# EAGLE design R212D (EAGLE 4.11)
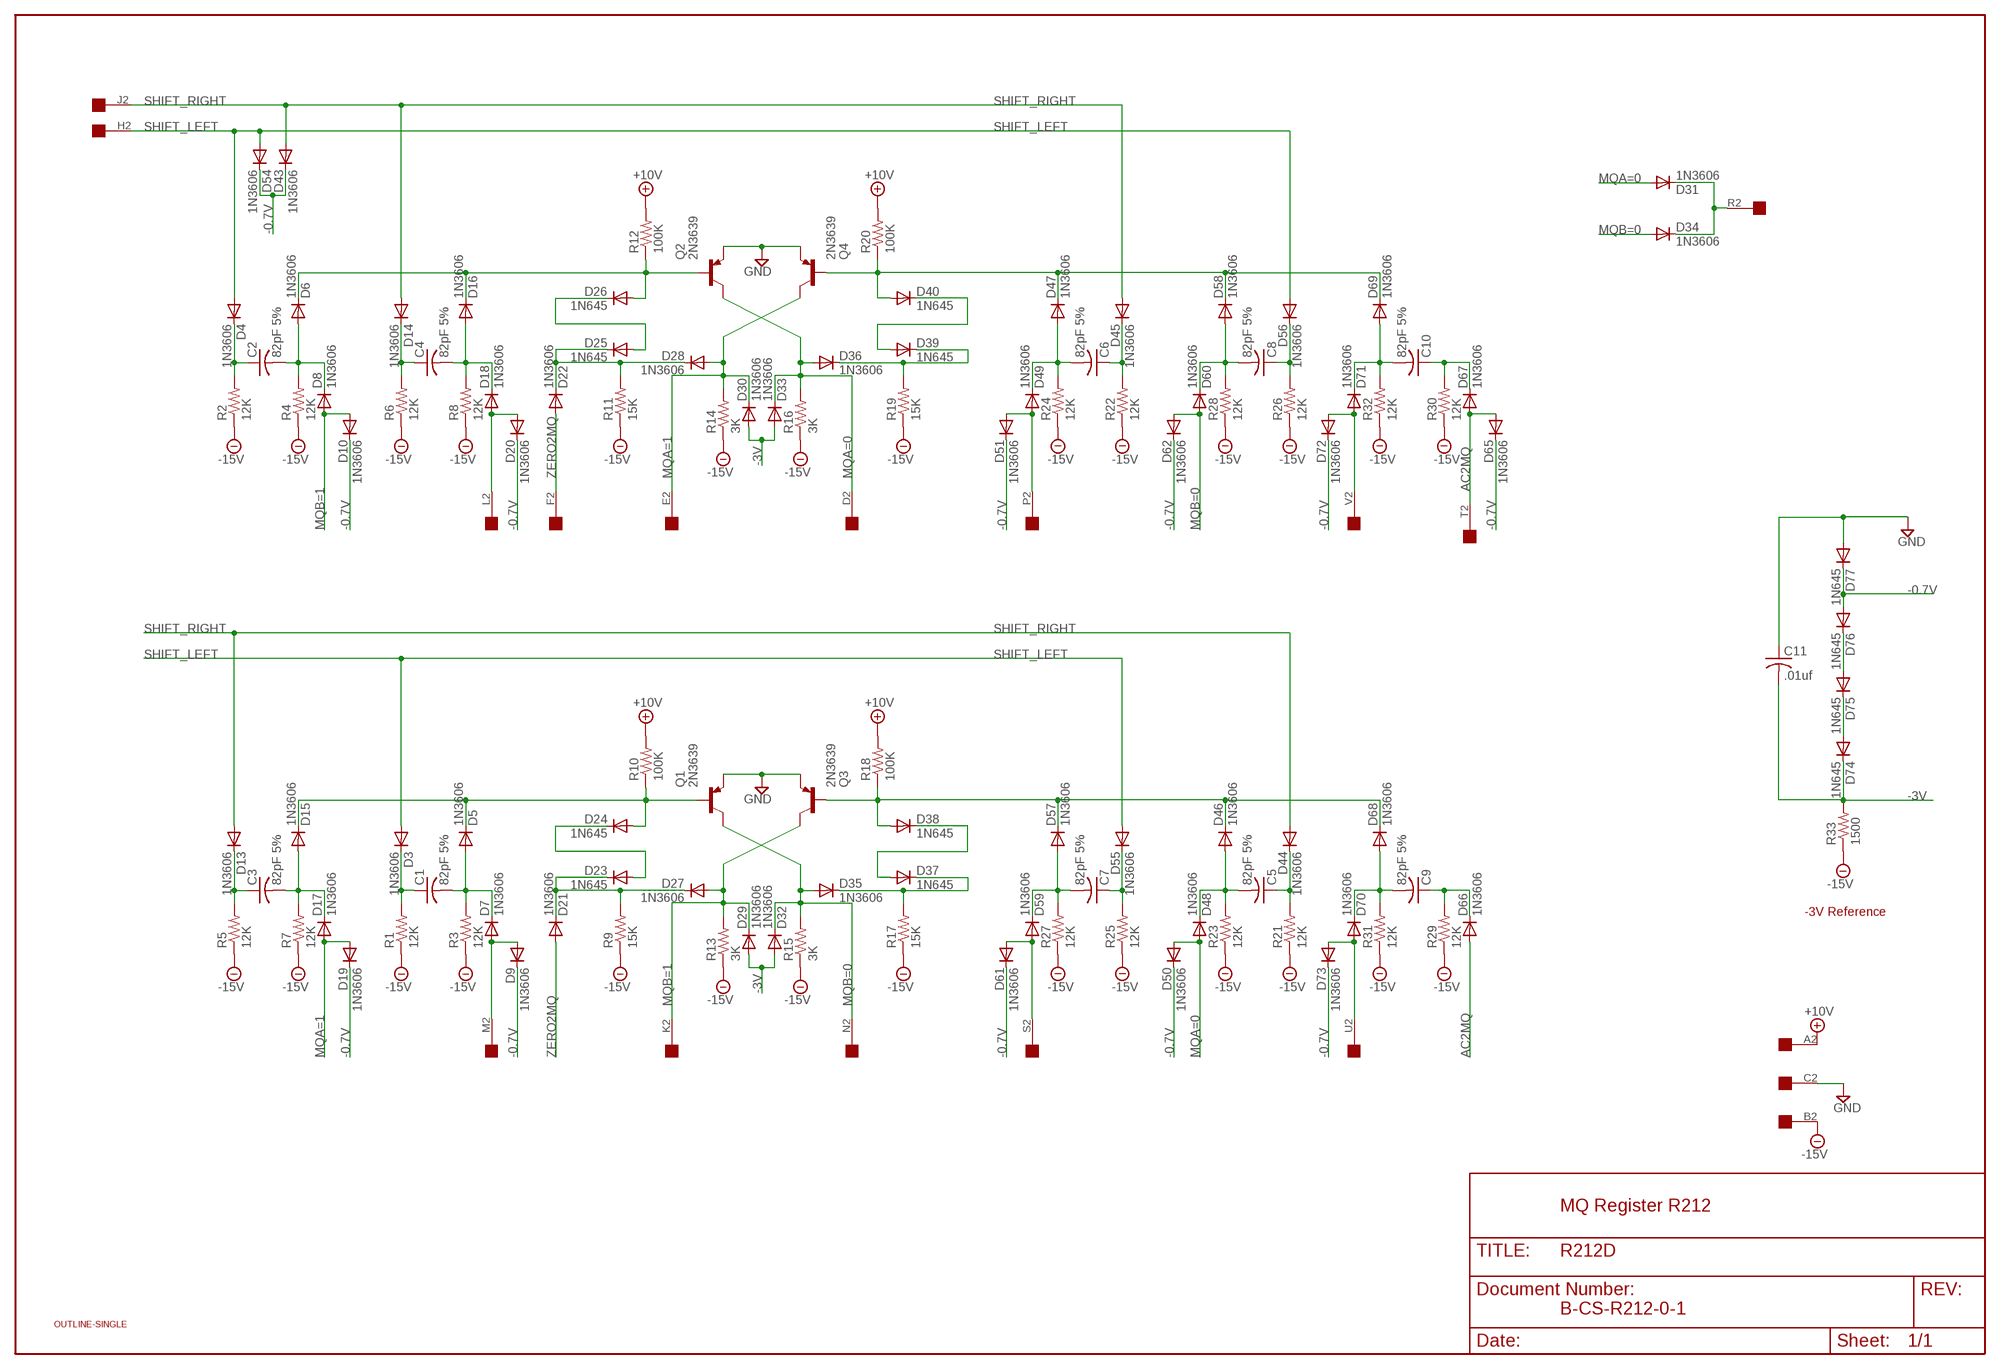
[diagram p0: schematic, sheet 1]

## Parts
C1  82pF 5%  C-US050-025X075  [C050-025X075]
C2  82pF 5%  C-US050-025X075  [C050-025X075]
C3  82pF 5%  C-US050-025X075  [C050-025X075]
C4  82pF 5%  C-US050-025X075  [C050-025X075]
C5  82pF 5%  C-US050-025X075  [C050-025X075]
C6  82pF 5%  C-US050-025X075  [C050-025X075]
C7  82pF 5%  C-US050-025X075  [C050-025X075]
C8  82pF 5%  C-US050-025X075  [C050-025X075]
C9  82pF 5%  C-US050-025X075  [C050-025X075]
C10  82pF 5%  C-US050-025X075  [C050-025X075]
C11  .01uf  C-US050-025X075  [C050-025X075]
D3  1N3606  1N4148  [DO35-10]
D4  1N3606  1N4148  [DO35-10]
D5  1N3606  1N4148  [DO35-10]
D6  1N3606  1N4148  [DO35-10]
D7  1N3606  1N4148  [DO35-10]
D8  1N3606  1N4148  [DO35-10]
D9  1N3606  1N4148  [DO35-10]
D10  1N3606  1N4148  [DO35-10]
D13  1N3606  1N4148  [DO35-10]
D14  1N3606  1N4148  [DO35-10]
D15  1N3606  1N4148  [DO35-10]
D16  1N3606  1N4148  [DO35-10]
D17  1N3606  1N4148  [DO35-10]
D18  1N3606  1N4148  [DO35-10]
D19  1N3606  1N4148  [DO35-10]
D20  1N3606  1N4148  [DO35-10]
D21  1N3606  1N4148  [DO35-10]
D22  1N3606  1N4148  [DO35-10]
D23  1N645  1N4148  [DO35-10]
D24  1N645  1N4148  [DO35-10]
D25  1N645  1N4148  [DO35-10]
D26  1N645  1N4148  [DO35-10]
D27  1N3606  1N4148  [DO35-10]
D28  1N3606  1N4148  [DO35-10]
D29  1N3606  1N4148  [DO35-10]
D30  1N3606  1N4148  [DO35-10]
D31  1N3606  1N4148  [DO35-10]
D32  1N3606  1N4148  [DO35-10]
D33  1N3606  1N4148  [DO35-10]
D34  1N3606  1N4148  [DO35-10]
D35  1N3606  1N4148  [DO35-10]
D36  1N3606  1N4148  [DO35-10]
D37  1N645  1N4148  [DO35-10]
D38  1N645  1N4148  [DO35-10]
D39  1N645  1N4148  [DO35-10]
D40  1N645  1N4148  [DO35-10]
D43  1N3606  1N4148  [DO35-10]
D44  1N3606  1N4148  [DO35-10]
D45  1N3606  1N4148  [DO35-10]
D46  1N3606  1N4148  [DO35-10]
D47  1N3606  1N4148  [DO35-10]
D48  1N3606  1N4148  [DO35-10]
D49  1N3606  1N4148  [DO35-10]
D50  1N3606  1N4148  [DO35-10]
D51  1N3606  1N4148  [DO35-10]
D54  1N3606  1N4148  [DO35-10]
D55  1N3606  1N4148  [DO35-10]
D56  1N3606  1N4148  [DO35-10]
D57  1N3606  1N4148  [DO35-10]
D58  1N3606  1N4148  [DO35-10]
D59  1N3606  1N4148  [DO35-10]
D60  1N3606  1N4148  [DO35-10]
D61  1N3606  1N4148  [DO35-10]
D62  1N3606  1N4148  [DO35-10]
D65  1N3606  1N4148  [DO35-10]
D66  1N3606  1N4148  [DO35-10]
D67  1N3606  1N4148  [DO35-10]
D68  1N3606  1N4148  [DO35-10]
D69  1N3606  1N4148  [DO35-10]
D70  1N3606  1N4148  [DO35-10]
D71  1N3606  1N4148  [DO35-10]
D72  1N3606  1N4148  [DO35-10]
D73  1N3606  1N4148  [DO35-10]
D74  1N645  1N4148  [DO35-10]
D75  1N645  1N4148  [DO35-10]
D76  1N645  1N4148  [DO35-10]
D77  1N645  1N4148  [DO35-10]
Q1  2N3639  2N3637  [TO39]
Q2  2N3639  2N3637  [TO39]
Q3  2N3639  2N3637  [TO39]
Q4  2N3639  2N3637  [TO39]
R1  12K  R-US_0207/10  [0207/10]
R2  12K  R-US_0207/10  [0207/10]
R3  12K  R-US_0207/10  [0207/10]
R4  12K  R-US_0207/10  [0207/10]
R5  12K  R-US_0207/10  [0207/10]
R6  12K  R-US_0207/10  [0207/10]
R7  12K  R-US_0207/10  [0207/10]
R8  12K  R-US_0207/10  [0207/10]
R9  15K  R-US_0207/10  [0207/10]
R10  100K  R-US_0207/10  [0207/10]
R11  15K  R-US_0207/10  [0207/10]
R12  100K  R-US_0207/10  [0207/10]
R13  3K  R-US_0207/10  [0207/10]
R14  3K  R-US_0207/10  [0207/10]
R15  3K  R-US_0207/10  [0207/10]
R16  3K  R-US_0207/10  [0207/10]
R17  15K  R-US_0207/10  [0207/10]
R18  100K  R-US_0207/10  [0207/10]
R19  15K  R-US_0207/10  [0207/10]
R20  100K  R-US_0207/10  [0207/10]
R21  12K  R-US_0207/10  [0207/10]
R22  12K  R-US_0207/10  [0207/10]
R23  12K  R-US_0207/10  [0207/10]
R24  12K  R-US_0207/10  [0207/10]
R25  12K  R-US_0207/10  [0207/10]
R26  12K  R-US_0207/10  [0207/10]
R27  12K  R-US_0207/10  [0207/10]
R28  12K  R-US_0207/10  [0207/10]
R29  12K  R-US_0207/10  [0207/10]
R30  12K  R-US_0207/10  [0207/10]
R31  12K  R-US_0207/10  [0207/10]
R32  12K  R-US_0207/10  [0207/10]
R33  1500  R-US_0207/10  [0207/10]
U$1  OUTLINE-SINGLE  [SINGLE]
U$2  EDGE-1  [EDGE-CON1]

## Nets
+10V [Power]: R10.2 R12.2 R18.2 R20.2 U$2.A2
-0.7V: D9.C D10.C D19.C D20.C D43.C D50.C D51.C D54.C D61.C D62.C D65.C D72.C D73.C D76.A D77.C
-3V [Power]: C11.2 D29.A D30.A D32.A D33.A D74.C R33.2
-15V [Power]: R1.1 R2.1 R3.1 R4.1 R5.1 R6.1 R7.1 R8.1 R9.1 R11.1 R13.1 R14.1 R15.1 R16.1 R17.1 R19.1 R21.1 R22.1 R23.1 R24.1 R25.1 R26.1 R27.1 R28.1 R29.1 R30.1 R31.1 R32.1 R33.1 U$2.B2
AC2MQ: D65.A D66.A D67.A U$2.T2
GND [Power]: C11.1 D77.A Q1.1(E) Q2.1(E) Q3.1(E) Q4.1(E) U$2.C2
MQA=0: D31.A D33.C D36.A D48.A D50.A Q2.3(C) R16.2 U$2.D2
MQA=1: D17.A D19.A D28.A D30.C Q4.3(C) R14.2 U$2.E2
MQB=0: D32.C D34.A D35.A D60.A D62.A Q1.3(C) R15.2 U$2.N2
MQB=1: D8.A D10.A D27.A D29.C Q3.3(C) R13.2 U$2.K2
N$1: D6.C D16.C D26.A Q2.2(B) R12.1
N$2: C2.1 D4.C R2.2
N$3: C2.2 D6.A D8.C R4.2
N$4: C10.1 D67.C R30.2
N$5: C4.1 D14.C R6.2
N$6: C4.2 D16.A D18.C R8.2
N$7: D18.A D20.A U$2.L2
N$8: D22.C D25.C D28.C R11.2
N$9: D25.A D26.C
N$10: C10.2 D69.A D71.C R32.2
N$11: D71.A D72.A U$2.V2
N$12: D40.A D47.C D58.C D69.C Q4.2(B) R20.1
N$13: D75.A D76.C
N$14: D31.C D34.C U$2.R2
N$15: C8.1 D56.C R26.2
N$16: D74.A D75.C
N$17: C8.2 D58.A D60.C R28.2
N$18: D5.C D15.C D24.A Q1.2(B) R10.1
N$19: C6.1 D45.C R22.2
N$20: C6.2 D47.A D49.C R24.2
N$21: D49.A D51.A U$2.P2
N$22: D36.C D39.C R19.2
N$23: D39.A D40.C
N$24: C3.1 D13.C R5.2
N$25: C3.2 D15.A D17.C R7.2
N$26: C1.1 D3.C R1.2
N$27: C1.2 D5.A D7.C R3.2
N$28: D7.A D9.A U$2.M2
N$29: D21.C D23.C D27.C R9.2
N$30: D23.A D24.C
N$31: C5.1 D44.C R21.2
N$32: C5.2 D46.A D48.C R23.2
N$33: C7.1 D55.C R25.2
N$34: C7.2 D57.A D59.C R27.2
N$35: D59.A D61.A U$2.S2
N$36: D35.C D37.C R17.2
N$37: D37.A D38.C
N$38: D38.A D46.C D57.C D68.C Q3.2(B) R18.1
N$39: C9.1 D66.C R29.2
N$40: C9.2 D68.A D70.C R31.2
N$41: D70.A D73.A U$2.U2
SHIFT_LEFT: D3.A D4.A D54.A D55.A D56.A U$2.H2
SHIFT_RIGHT: D13.A D14.A D43.A D44.A D45.A U$2.J2
ZERO2MQ: D21.A D22.A U$2.F2

## Notes on the sheet
- -3V Reference
- MQ Register R212
- B-CS-R212-0-1

## Library data of the parts
C1-C11 = rcl:C-US: CAPACITOR, American symbol
D3-D10 D13-D40 D43-D51 D54-D62 D65-D77 = diode:1N4148: DIODE high speed (Philips)
Q1-Q4 = transistor-pnp:2N3637*: PNP Transistror
R1-R33 = rcl:R-US_: RESISTOR, American symbol
U$1 = dec-con:OUTLINE-*: Board outlines for DEC boards.
U$2 = dec-con:EDGE-1: Single-Sided DEC Edge Connector -- (side 2)

## Net classes
1 Power: width 0.813 mm

## Board
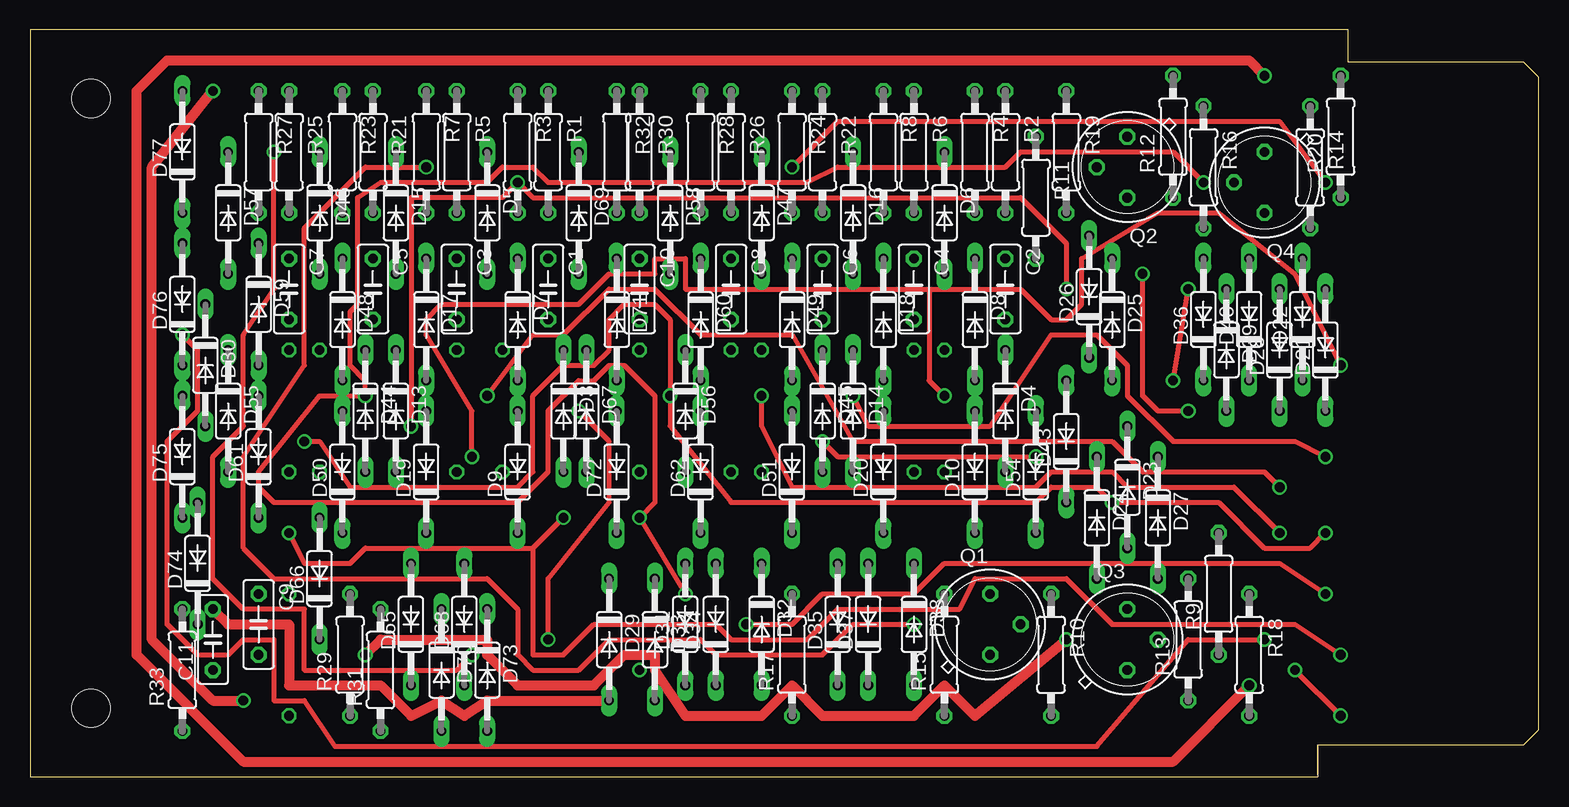
[diagram p1: board, top side]
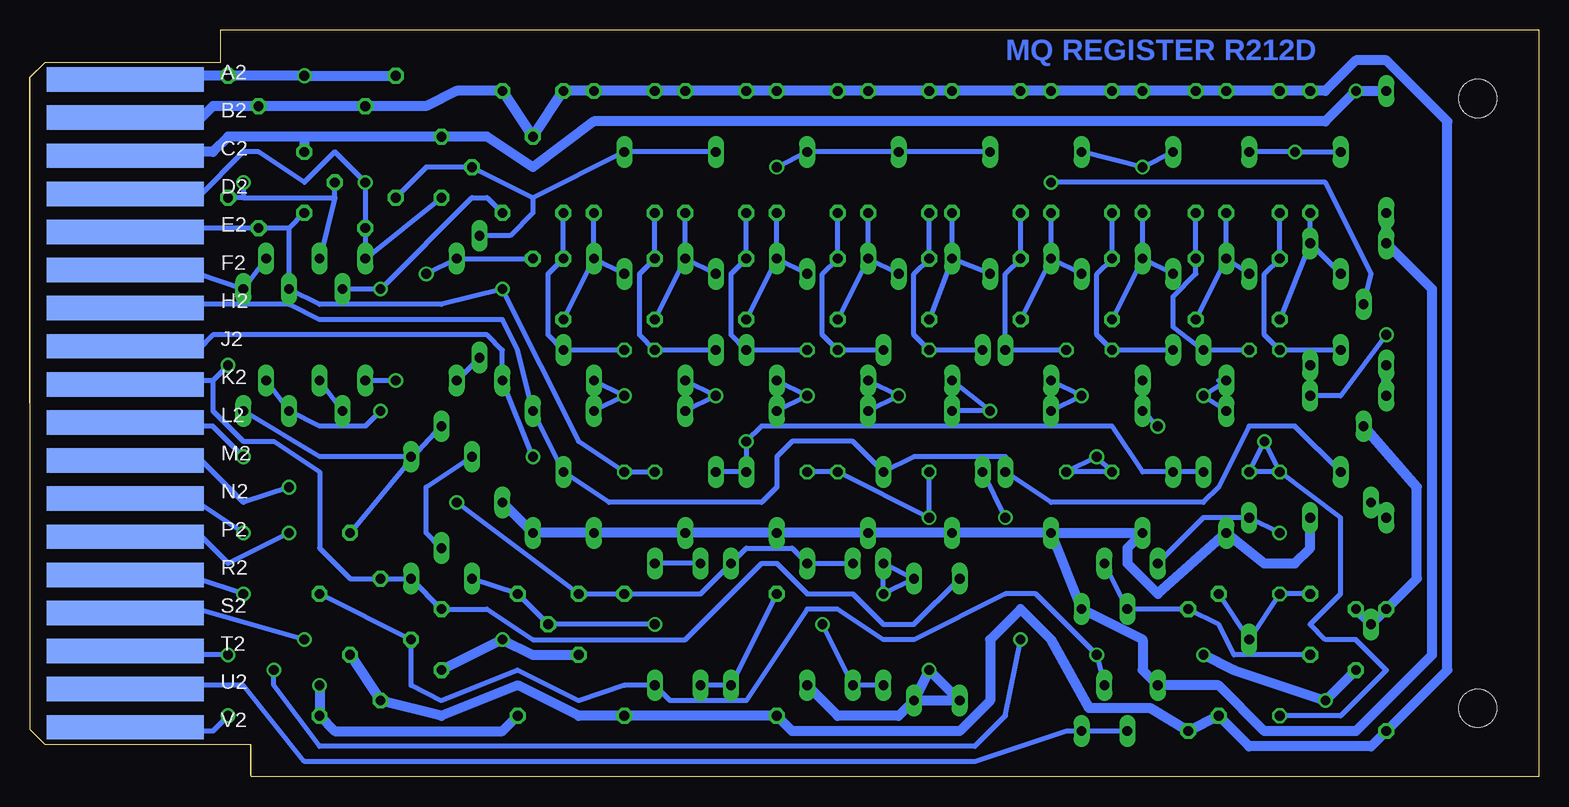
[diagram p2: board, bottom side, seen from below]

Size 125.73 x 62.23 mm. Coordinates in mm from the lower left corner, seen from the top.
Copper layers (1+16): Top 0.035mm / dielectric 1.5mm / Bottom 0.035mm
Design rules "16mils": minimum track width 16mil, minimum drill 32mil, track to track 15mil, track to pad 10mil, pad to pad 10mil, via to via 10mil, smd to smd 10mil, copper to edge 13mil, drill to drill 10mil, minimum pad ring 10mil, minimum via ring 8mil, stop-mask expansion 0mil, vias tented up to drill 0mil, thermal gap 10mil

### Footprints (pad centres in the part's own frame; a part is rotated, then mirrored left to right if it is on the bottom)
C050-025X075 = drill 0.813 octagon: 1 -2.54,0; 2 2.54,0
DO35-10 = drill 0.813 long: A 5.08,0; C -5.08,0
TO39 = drill 0.813 octagon: 1 0,-2.54; 2 2.54,0; 3 0,2.54
0207/10 = drill 0.813 octagon: 1 -5.08,0; 2 5.08,0
SINGLE = hole 3.175: 120.65,56.515; 120.65,5.715
EDGE-CON1 = smd 13.106 x 2.032 bottom: A2 7.938,4.128; B2 7.938,7.303; C2 7.938,10.477; D2 7.938,13.652; E2 7.938,16.828; F2 7.938,20.003; H2 7.938,23.177; J2 7.938,26.352; K2 7.938,29.527; L2 7.938,32.703; M2 7.938,35.877; N2 7.938,39.053; P2 7.938,42.227; R2 7.938,45.403; S2 7.938,48.578; T2 7.938,51.752; U2 7.938,54.928; V2 7.938,58.102

### Placement (x,y rotation side)
C1  43.18,40.64 270 top
C2  81.28,40.64 270 top
C3  35.56,40.64 270 top
C4  73.66,40.64 270 top
C5  28.57,40.64 270 top
C6  66.04,40.64 270 top
C7  21.59,40.64 270 top
C8  58.42,40.64 270 top
C9  19.05,12.7 270 top
C10  50.8,40.64 270 top
C11  15.24,11.43 90 top
D3  44.45,30.48 270 top
D4  81.28,30.48 270 top
D5  38.1,46.99 270 top
D6  76.2,46.99 270 top
D7  40.64,38.1 270 top
D8  78.74,38.1 270 top
D9  40.64,25.4 90 top
D10  78.74,25.4 90 top
D13  30.48,30.48 270 top
D14  68.58,30.48 270 top
D15  30.48,46.99 270 top
D16  68.58,46.99 270 top
D17  33.02,38.1 270 top
D18  71.12,38.1 270 top
D19  33.02,25.4 90 top
D20  71.12,25.4 90 top
D21  107.95,35.56 90 top
D22  106.05,38.1 90 top
D23  91.44,24.13 270 top
D24  88.9,21.59 270 top
D25  90.17,38.1 270 top
D26  88.27,40.01 90 top
D27  93.98,21.59 270 top
D28  104.14,35.56 90 top
D29  48.26,11.43 270 top
D30  14.61,34.29 270 top
D31  54.61,12.7 90 top
D32  60.96,12.7 270 top
D33  52.07,11.43 270 top
D34  57.15,12.7 90 top
D35  67.31,12.7 90 top
D36  97.79,38.1 90 top
D37  69.85,12.7 90 top
D38  73.66,12.7 270 top
D39  99.69,35.56 270 top
D40  101.6,38.1 90 top
D43  86.36,27.94 90 top
D44  27.94,30.48 270 top
D45  66.04,30.48 270 top
D46  24.13,46.99 270 top
D47  60.96,46.99 270 top
D48  26.04,38.1 270 top
D49  63.5,38.1 270 top
D50  26.04,25.4 90 top
D51  63.5,25.4 90 top
D54  83.82,25.4 90 top
D55  16.51,30.48 270 top
D56  54.61,30.48 270 top
D57  16.51,46.99 270 top
D58  53.34,46.99 270 top
D59  19.05,39.37 270 top
D60  55.88,38.1 270 top
D61  19.05,26.67 90 top
D62  55.88,25.4 90 top
D65  31.75,12.7 90 top
D66  24.13,16.51 90 top
D67  46.35,30.48 270 top
D68  36.2,12.7 90 top
D69  45.72,46.99 270 top
D70  34.29,8.89 270 top
D71  48.9,38.1 270 top
D72  48.9,25.4 90 top
D73  38.1,8.89 270 top
D74  13.97,17.78 90 top
D75  12.7,26.67 90 top
D76  12.7,39.37 90 top
D77  12.7,52.07 90 top
Q1  80.01,12.7 0 top
Q2  91.44,50.8 180 top
Q3  91.44,11.43 0 top
Q4  102.87,49.53 180 top
R1  43.18,52.07 270 top
R2  81.28,52.07 270 top
R3  40.64,52.07 270 top
R4  78.74,52.07 270 top
R5  35.56,52.07 270 top
R6  73.66,52.07 270 top
R7  33.02,52.07 270 top
R8  71.12,52.07 270 top
R9  99.06,15.24 90 top
R10  85.09,10.16 270 top
R11  83.82,48.26 270 top
R12  95.25,53.34 90 top
R13  96.52,11.43 90 top
R14  106.68,50.8 270 top
R15  76.2,10.16 90 top
R16  97.79,50.8 270 top
R17  63.5,10.16 90 top
R18  101.6,10.16 270 top
R19  86.36,52.07 270 top
R20  109.22,53.34 90 top
R21  28.57,52.07 270 top
R22  66.04,52.07 270 top
R23  26.04,52.07 270 top
R24  63.5,52.07 270 top
R25  21.59,52.07 270 top
R26  58.42,52.07 270 top
R27  19.05,52.07 270 top
R28  55.88,52.07 270 top
R29  26.67,10.16 90 top
R30  50.8,52.07 270 top
R31  29.21,8.89 90 top
R32  48.9,52.07 270 top
R33  12.7,8.89 90 top
U$1  125.73,62.23 180 top
U$2  125.73,62.23 180 top

### Tracks (layer width: path | path; a pad name or v marks a point on that pad's centre or on a via)
+10V  (via drill 0.81)
  Top 0.813: v102.87,58.42 101.6,59.69 11.43,59.69 8.89,57.15 8.89,10.16 17.78,1.27 95.25,1.27 v101.6,7.62
  Bottom 0.813: U$2.A2 116.84,58.42 R20.2 v102.87,58.42 R12.2 | R10.2 86.36,3.81 100.33,3.81 R18.2 v101.6,7.62
-0.7V
  Bottom 0.813: D43.C D54.C D10.C D20.C D51.C D62.C D72.C D9.C | D9.C D19.C 34.29,19.05 34.29,17.78 31.75,15.24 D50.C 22.86,17.78 20.32,17.78 19.05,19.05 D61.C | D9.C D73.C 33.02,11.43 33.02,8.89 D65.C 26.67,7.62 22.86,3.81 15.24,3.81 8.89,10.16 8.89,40.64 D76.A D77.C
-3V  (via drill 0.81)
  Top 0.813: C11.2 16.51,12.7 21.59,12.7 21.59,7.62 29.21,7.62 31.75,5.08 34.29,6.35 36.2,5.08 38.1,6.35 D29.A
  Bottom 0.813: C11.2 D74.C R33.2 10.16,16.51 10.16,24.13 D30.A | D32.A 58.42,5.08 53.34,5.08 D33.A | D33.A v50.8,8.89 D29.A D33.A
-15V
  Bottom 0.813: U$2.B2 116.84,54.61 111.76,54.61 110.49,55.88 R14.1 R16.1 92.71,55.88 90.17,57.15 R19.1 R11.1 R2.1 R4.1 R6.1 R8.1 R22.1 R24.1 R26.1 R28.1 R30.1 R32.1 R1.1 R3.1 R5.1 R7.1 R21.1 R23.1 R25.1 R27.1 17.78,57.15 15.24,59.69 12.7,59.69 7.62,54.61 7.62,8.89 R33.1 13.97,2.54 24.13,2.54 R29.1 R31.1 32.38,5.71 37.47,5.71 40.64,11.43 43.18,13.97 45.72,11.43 45.72,6.35 48.26,3.81 62.23,3.81 R17.1 R15.1 80.01,5.08 85.09,7.62 91.44,5.08 R13.1 R9.1
AC2MQ  (via drill 0.81)
  Top 0.406: v109.22,10.16 105.41,12.7 90.17,12.7 86.36,16.51 78.74,16.51 77.47,13.97 67.31,13.97 64.77,11.43 58.42,11.43 57.15,12.7 46.99,12.7 44.45,10.16 41.91,10.16 41.91,19.05 | 41.91,19.05 27.94,19.05 26.67,17.78 22.86,17.78 v21.59,20.32 | 41.91,19.05 v44.45,21.59
  Bottom 0.406: U$2.T2 116.84,10.16 v109.22,10.16 | v21.59,20.32 D66.A 27.94,21.59 D65.A | v44.45,21.59 D67.A
GND  (via drill 0.81)
  Top 0.813: v15.24,57.15 10.16,50.8 10.16,11.43 15.24,6.35 v17.78,6.35 | v86.36,11.43 78.74,5.08 76.2,7.62 73.66,5.08 66.04,5.08 63.5,7.62 60.96,5.08 54.61,5.08 52.07,8.89 52.07,10.16 49.53,10.16 46.99,7.62 40.64,7.62 38.1,10.16 38.1,11.43 29.21,11.43 v27.94,10.16
  Bottom 0.813: Q3.1 v86.36,11.43 83.82,10.16 Q1.1 | U$2.C2 116.84,52.07 110.49,52.07 109.22,53.34 102.87,53.34 | D77.A v15.24,57.15 17.78,54.61 78.74,54.61 83.82,50.8 87.63,53.34 Q2.1 102.87,53.34 | 102.87,53.34 Q4.1 | C11.1 v17.78,6.35 25.4,8.89 v27.94,10.16
MQA=0  (via drill 0.81)
  Top 0.406: v54.61,15.24 v50.8,21.59 52.07,22.86 52.07,31.75 49.53,34.29 48.26,34.29 46.99,33.02 45.72,33.02 43.18,30.48 43.18,25.4 40.64,22.86 20.32,22.86 19.05,24.13 19.05,25.4 24.13,31.75 v27.94,31.75 27.94,33.02 26.67,34.29 26.67,38.73 27.3,39.37 27.3,48.26 29.21,49.53 38.1,49.53 39.37,50.8 41.91,50.8 43.18,49.53 64.77,49.53 67.31,50.8 81.28,50.8 82.55,52.07 95.25,52.07 v97.79,49.53
  Bottom 0.406: Q2.3 D36.A R16.2 v97.79,49.53 100.33,52.07 102.87,49.53 106.68,52.07 107.95,52.07 111.76,48.26 116.84,48.26 U$2.D2 | v60.96,25.4 v58.42,25.4 v50.8,21.59 v50.8,25.4 | D48.A D50.A v27.94,31.75 D48.A | D48.A 26.67,33.02 | v54.61,15.24 D31.A D33.C v54.61,15.24
MQA=1  (via drill 0.81)
  Top 0.406: v86.36,40.64 86.36,44.45 82.55,48.26 41.91,48.26 v40.64,49.53 39.37,48.26 31.75,48.26 v31.75,29.21
  Bottom 0.406: U$2.E2 116.84,45.72 R14.2 104.14,45.72 | 104.14,45.72 D28.A 101.6,39.37 91.44,39.37 v86.36,40.64 80.01,27.94 v76.2,25.4 v73.66,25.4 | 104.14,45.72 Q4.3 | D17.A D19.A v31.75,29.21 | D30.C 13.97,41.91 17.78,49.53 v40.64,49.53
MQB=0  (via drill 0.81)
  Top 0.406: v107.95,20.32 106.68,19.05 102.87,19.05 99.06,22.86 v90.17,22.86 88.9,24.13 85.09,24.13 83.82,22.86 58.42,22.86 53.34,29.21 v53.34,31.75 53.34,38.1 52.07,39.37 49.53,39.37 48.26,38.1 48.26,35.56 46.99,34.29 44.45,34.29 41.91,31.75 41.91,25.4 40.64,24.13 26.67,24.13 24.13,27.94 v22.86,27.94
  Bottom 0.406: v90.17,22.86 Q1.3 R15.2 69.85,15.24 D35.A 66.04,19.05 62.23,19.05 D32.C D34.A | U$2.N2 116.84,22.86 111.76,22.86 v107.95,20.32 | v21.59,5.08 16.51,5.08 12.7,8.89 15.24,11.43 17.78,11.43 19.05,12.7 16.51,15.24 16.51,21.59 v21.59,25.4 | v21.59,25.4 v24.13,25.4 v22.86,27.94 v21.59,25.4 | v53.34,31.75 D60.A D62.A v53.34,31.75
MQB=1  (via drill 0.81)
  Top 0.406: v109.22,34.29 105.41,41.91 99.06,46.99 93.98,46.99 87.63,43.18 87.63,39.37 86.36,38.1 85.09,38.1 82.55,40.64 74.93,40.64 | 74.93,40.64 74.93,33.02 v76.2,31.75 | v36.83,26.67 36.83,30.48 33.02,36.83 33.02,38.1 34.29,39.37 45.72,39.37 48.26,41.91 52.07,41.91 52.07,43.18 54.61,43.18 54.61,40.64 74.93,40.64
  Bottom 0.406: U$2.K2 117.14,32.72 116.84,33.02 110.49,33.02 | v109.22,34.29 110.49,33.02 | 110.49,33.02 110.49,30.48 107.95,27.94 105.41,27.94 101.6,25.4 101.6,19.05 99.06,16.51 R13.2 D27.A Q3.3 87.63,13.97 83.82,11.43 71.12,11.43 64.77,17.78 63.5,17.78 60.96,15.24 57.15,15.24 54.61,12.7 52.07,12.7 D29.C | D8.A D10.A v76.2,31.75 D8.A | v36.83,26.67 v35.56,25.4 v39.37,25.4 v36.83,26.67
N$1
  Bottom 0.406: D16.C D6.C 83.82,48.26 | 83.82,48.26 83.82,46.99 85.72,45.09 D26.A | 83.82,48.26 Q2.2 92.71,50.8 R12.1
N$2  (via drill 0.81)
  Bottom 0.406: v76.2,35.56 D4.C 82.55,36.83 82.55,41.91 C2.1 R2.2
N$3
  Bottom 0.406: D8.C R4.2 | D6.A D8.C | D8.C C2.2
N$4  (via drill 0.81)
  Bottom 0.406: R30.2 C10.1 52.07,41.91 52.07,36.83 v50.8,35.56 D67.C
N$5  (via drill 0.81)
  Bottom 0.406: D14.C v73.66,35.56 74.93,36.83 74.93,41.91 C4.1 R6.2
N$6
  Bottom 0.406: D18.C R8.2 | D16.A D18.C | D18.C C4.2
N$7  (via drill 0.81)
  Top 0.406: v107.95,26.67 105.41,27.94 95.25,27.94 91.44,31.75 91.44,34.29 88.9,36.83 85.09,36.83 80.01,29.21 69.85,29.21 v68.58,31.75
  Bottom 0.406: U$2.L2 116.84,29.21 110.49,29.21 v107.95,26.67 | D20.A D18.A v68.58,31.75 D20.A
N$8  (via drill 0.81)
  Top 0.406: v96.52,30.48 93.98,30.48 92.71,31.75 v92.71,41.91
  Bottom 0.406: D22.C D28.C 101.6,29.21 97.79,29.21 v96.52,30.48 | R11.2 D25.C v92.71,41.91
N$9
  Bottom 0.406: D26.C D25.A
N$10
  Bottom 0.406: D71.C R32.2 | D69.A D71.C | D71.C C10.2
N$11  (via drill 0.81)
  Top 0.406: v105.41,8.89 v109.22,5.08 | v43.18,11.43 43.18,16.51 48.26,22.86 48.26,27.94 v45.72,30.48
  Bottom 0.406: U$2.V2 116.84,3.81 110.49,3.81 v109.22,5.08 | v105.41,8.89 105.41,7.62 101.6,2.54 46.99,2.54 44.45,5.08 v43.18,11.43 | v45.72,30.48 D72.A D71.A v45.72,30.48
N$12  (via drill 0.81)
  Top 0.406: v107.95,49.53 104.14,54.61 67.31,54.61 v63.5,50.8
  Bottom 0.406: 100.33,48.26 D40.A | 100.33,48.26 Q4.2 | 107.95,48.26 100.33,48.26 | 107.95,48.26 R20.1 | v107.95,49.53 107.95,48.26 | D69.C D58.C D47.C v63.5,50.8
N$13
  Bottom 0.813: D75.A D76.C
N$14  (via drill 0.81)
  Top 0.406: v107.95,15.24 104.14,17.78 76.2,17.78 73.66,15.24 66.04,15.24 63.5,12.7 v59.69,12.7
  Bottom 0.406: U$2.R2 116.84,16.51 111.76,16.51 v107.95,15.24 | D31.C D34.C v59.69,12.7
N$15  (via drill 0.81)
  Bottom 0.406: R26.2 C8.1 59.69,41.91 59.69,36.83 v58.42,35.56 D56.C
N$16
  Bottom 0.813: D75.C D74.A
N$17
  Bottom 0.406: D60.C R28.2 | D60.C C8.2 | D58.A D60.C
N$18  (via drill 0.81)
  Top 0.406: v73.66,12.7 68.58,12.7 66.04,10.16 57.15,10.16 55.88,11.43 48.26,11.43 45.72,8.89 41.91,8.89 40.64,10.16 40.64,13.97 38.1,16.51 20.32,16.51 17.78,19.05 17.78,26.67 22.86,34.29 22.86,45.72 27.94,50.8 v33.02,50.8
  Bottom 0.406: v73.66,12.7 Q1.2 R10.1 D24.A | D15.C v33.02,50.8 D5.C
N$19  (via drill 0.81)
  Bottom 0.406: R22.2 C6.1 67.31,41.91 67.31,36.83 D45.C v60.96,35.56
N$20
  Bottom 0.406: D47.A D49.C | D49.C C6.2 | D49.C R24.2
N$21  (via drill 0.81)
  Top 0.406: v104.14,20.32 100.33,24.13 91.44,24.13 90.17,25.4 85.09,25.4 83.82,24.13 63.5,24.13 60.96,29.21 v60.96,31.75
  Bottom 0.406: U$2.P2 116.84,20.32 111.76,20.32 109.22,17.78 v104.14,20.32 | v60.96,31.75 D49.A D51.A v60.96,31.75
N$22  (via drill 0.81)
  Top 0.406: v95.25,33.02 v96.52,40.64
  Bottom 0.406: R19.2 87.63,48.26 88.9,48.26 v96.52,40.64 D39.C | v95.25,33.02 D36.C
N$23
  Bottom 0.406: D39.A D40.C
N$24  (via drill 0.81)
  Bottom 0.406: R5.2 C3.1 36.83,41.91 36.83,36.83 v35.56,35.56 D13.C
N$25
  Bottom 0.406: D15.A D17.C | D17.C C3.2 | D17.C R7.2
N$26  (via drill 0.81)
  Bottom 0.406: R1.2 C1.1 44.45,41.91 D3.C v39.37,35.56
N$27
  Bottom 0.406: D7.C R3.2 | D7.C C1.2 | D5.A D7.C
N$28  (via drill 0.81)
  Top 0.406: v104.14,24.13 102.87,25.4 92.71,25.4 90.17,27.94 68.58,27.94 63.5,36.83 55.88,36.83 52.07,40.64 48.26,40.64 44.45,36.83 41.91,36.83 v38.1,31.75
  Bottom 0.406: U$2.M2 116.84,26.67 111.76,26.67 107.95,22.86 v104.14,24.13 | v38.1,31.75 D9.A D7.A v38.1,31.75
N$29
  Bottom 0.406: 93.88,26.58 R9.2 | 93.88,26.58 D23.C | D21.C 101.6,26.67 D27.C 93.88,26.58
N$30
  Bottom 0.406: D24.C 92.71,24.13 92.71,20.32 D23.A
N$31  (via drill 0.81)
  Bottom 0.406: v24.13,35.56 D44.C 30.48,37.47 30.48,40.01 28.57,41.91 C5.1 R21.2
N$32
  Bottom 0.406: D48.C R23.2 | D46.A D48.C | D48.C C5.2
N$33  (via drill 0.81)
  Bottom 0.406: R25.2 C7.1 22.86,41.91 22.86,36.83 v21.59,35.56 D55.C
N$34
  Bottom 0.406: D57.A D59.C | D59.C C7.2 | D59.C R27.2
N$35  (via drill 0.81)
  Top 0.406: v102.87,11.43 96.52,11.43 88.9,2.54 25.4,2.54 22.86,6.35 20.32,6.35 20.32,11.43 17.78,11.43 16.51,10.16 13.97,10.16 11.43,12.7 11.43,27.94 13.97,30.48 13.97,35.56 v12.7,36.83
  Bottom 0.406: U$2.S2 116.84,13.97 111.76,13.97 v102.87,11.43 | D59.A D61.A 16.51,31.75 v12.7,36.83
N$36
  Bottom 0.406: D37.C D35.C R17.2
N$37
  Bottom 0.406: D37.A D38.C
N$38  (via drill 0.81)
  Top 0.406: v20.32,52.07 20.32,40.64 17.78,36.83 17.78,29.21 15.24,26.67 15.24,16.51 17.78,13.97 22.86,13.97 22.86,8.89 35.56,8.89 v36.83,10.16
  Bottom 0.406: R18.1 Q3.2 93.98,7.62 91.44,6.35 85.09,8.89 80.01,6.35 76.2,7.62 D38.A 72.39,6.35 66.04,6.35 60.96,13.97 58.42,13.97 54.61,11.43 52.07,11.43 44.45,15.24 41.91,15.24 v36.83,10.16 D68.C | D57.C v20.32,52.07 D46.C
N$39  (via drill 0.81)
  Bottom 0.406: R29.2 D66.C v21.59,15.24 C9.1
N$40
  Bottom 0.406: C9.2 25.4,10.16 26.67,12.7 R31.2 D70.C D68.A
N$41
  Bottom 0.406: U$2.U2 117.2,7.26 116.84,7.62 107.95,7.62 102.87,1.27 46.99,1.27 39.37,3.81 D73.A D70.A
SHIFT_LEFT
  Bottom 0.406: U$2.H2 116.84,39.37 104.14,39.37 101.6,38.1 86.36,38.1 85.09,35.56 D54.A D4.A 77.47,22.86 64.77,22.86 63.5,24.13 63.5,26.67 62.23,27.94 57.15,27.94 D56.A 52.07,26.67 44.45,26.67 D3.A 40.64,22.86 27.94,22.86 26.67,24.13 24.13,29.21 20.32,29.21 D55.A
SHIFT_RIGHT  (via drill 0.81)
  Top 0.406: v83.82,26.67 67.31,26.67 v66.04,27.94
  Bottom 0.406: U$2.J2 116.84,35.56 111.76,35.56 110.49,36.83 87.63,36.83 86.36,35.56 D43.A v83.82,26.67 | D14.A D45.A v66.04,27.94 64.77,29.21 35.56,29.21 33.02,25.4 D13.A D44.A
ZERO2MQ
  Bottom 0.406: U$2.F2 116.84,41.91 111.76,41.91 D21.A D22.A

### Text on the board
Bottom: MQ REGISTER R212D
200bmp: C:/Users/Vince/Documents/websvn/trunk/Eagle/projects/DEC/Rxxx/R212/R212Dbackb.bmp